# EAGLE design Pi3_motor_hat_rev1 (EAGLE 7.3.0)

## Sheet 1 of 2
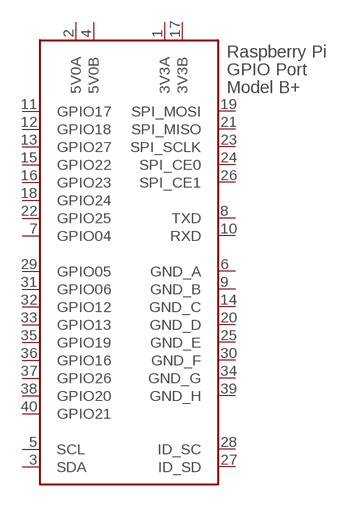
[diagram p0: schematic, sheet 1]

### Parts
X1  RASPI_BOARD_B+#_HDC  [RASPI_BOARD_B+HAT_DF_CF]
Unconnected: X1.3(SDA) X1.5(SCL) X1.7(GPIO04) X1.8(TXD) X1.10(RXD) X1.11(GPIO17) X1.12(GPIO18) X1.13(GPIO27) X1.15(GPIO22) X1.16(GPIO23) X1.18(GPIO24) X1.19(SPI_MOSI) X1.21(SPI_MISO) X1.22(GPIO25) X1.23(SPI_SCLK) X1.24(SPI_CE0) X1.26(SPI_CE1) X1.27(ID_SD) X1.28(ID_SC) X1.29(GPIO05) X1.31(GPIO06) X1.32(GPIO12) X1.33(GPIO13) X1.35(GPIO19) X1.36(GPIO16) X1.37(GPIO26) X1.38(GPIO20) X1.40(GPIO21)

## Sheet 2 of 2
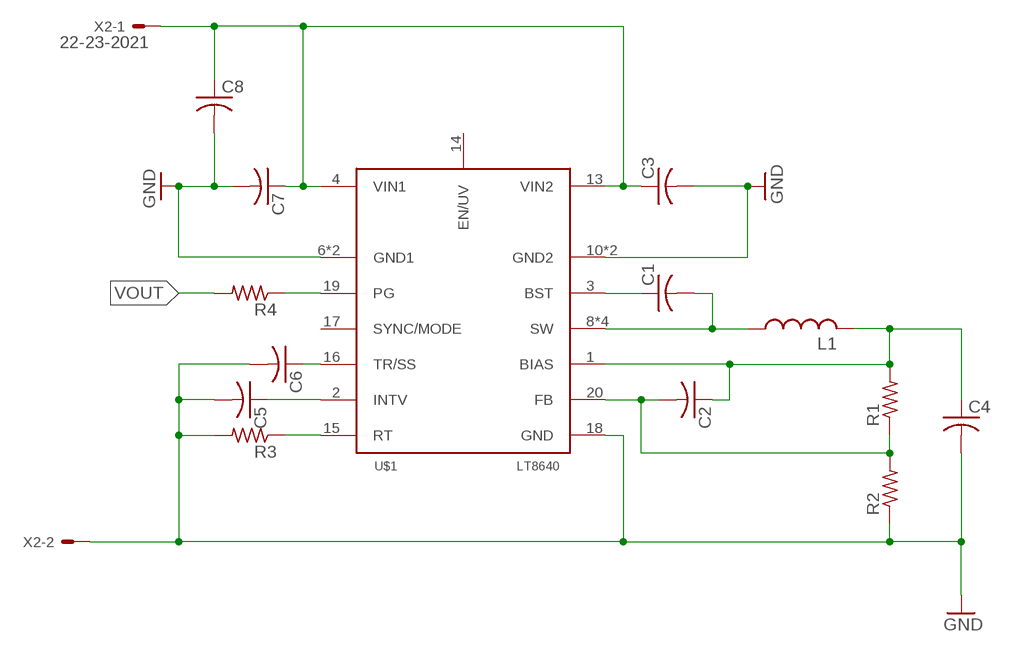
[diagram p1: schematic, sheet 2]

### Parts
C1  C-USC0402  [C0402]
C2  C-USC0402  [C0402]
C3  C-USC0402  [C0402]
C4  C-USC1210  [C1210]
C5  C-USC0402  [C0402]
C6  C-USC0402  [C0402]
C7  C-USC0402  [C0402]
C8  C-USC0603  [C0603]
L1  L-USIHLP2525EZER4R7M01  [IHLP2525EZER4R7M01-FOOT]
R1  R-US_R0402  [R0402]
R2  R-US_R0402  [R0402]
R3  R-US_R0402  [R0402]
R4  R-US_R0402  [R0402]
U$1  LT8640  [LT8640_FOOT]
X2  22-23-2021  [22-23-2021]

### Nets
GND: C3.2 C4.2 C5.2 C6.2 C7.2 C8.2 R2.1 R3.2 U$1.6(GND1) U$1.7(GND1) U$1.10(GND2) U$1.11(GND2) U$1.18(GND) X2.2
N$1: C1.1 U$1.3(BST)
N$2: C1.2 L1.1 U$1.8(SW) U$1.9(SW) U$1.21(SW) U$1.22(SW)
N$3: R4.1 U$1.19(PG)
N$5: C2.2 R1.1 R2.2 U$1.20(FB)
N$10: C6.1 U$1.16(TR/SS)
N$11: C5.1 U$1.2(INTV)
N$12: R3.1 U$1.15(RT)
VIN: C3.1 C7.1 C8.1 U$1.4(VIN1) U$1.13(VIN2) X2.1
VOUT: C2.1 C4.1 L1.2 R1.2 R4.2 U$1.1(BIAS)
Unconnected: U$1.14(EN/UV) U$1.17(SYNC/MODE)

## Power pins joined to a net without a drawn wire
3V3A: X1.1(3V3A)
3V3B: X1.17(3V3B)
5V0A: X1.2(5V0A)
5V0B: X1.4(5V0B)
GND_A: X1.6(GND_A)
GND_B: X1.9(GND_B)
GND_C: X1.14(GND_C)
GND_D: X1.20(GND_D)
GND_E: X1.25(GND_E)
GND_F: X1.30(GND_F)
GND_G: X1.34(GND_G)
GND_H: X1.39(GND_H)

## Library data of the parts
C1-C8 = rcl:C-US: CAPACITOR, American symbol
L1 = Pi3_motor_hat_rev1:L-US: INDUCTOR, American symbol
R1-R4 = rcl:R-US_: RESISTOR, American symbol
U$1 = Pi3_motor_hat_rev1:LT8640
X1 = raspberrypi_bastelstube_v13:RASPI_BOARD_B+#: Raspberry Pi GPIO connector with markings for the outer dimensions of the Raspberry Pi board model B+ with different sets of drill holes or mounting pads All pins connected
X2 = con-molex:22-23-2021: .100" (2.54mm) Center Header - 2 Pin; MF: MOLEX; MPN: 22-23-2021; OC_FARNELL: 1462926; OC_NEWARK: 25C3832

## Board
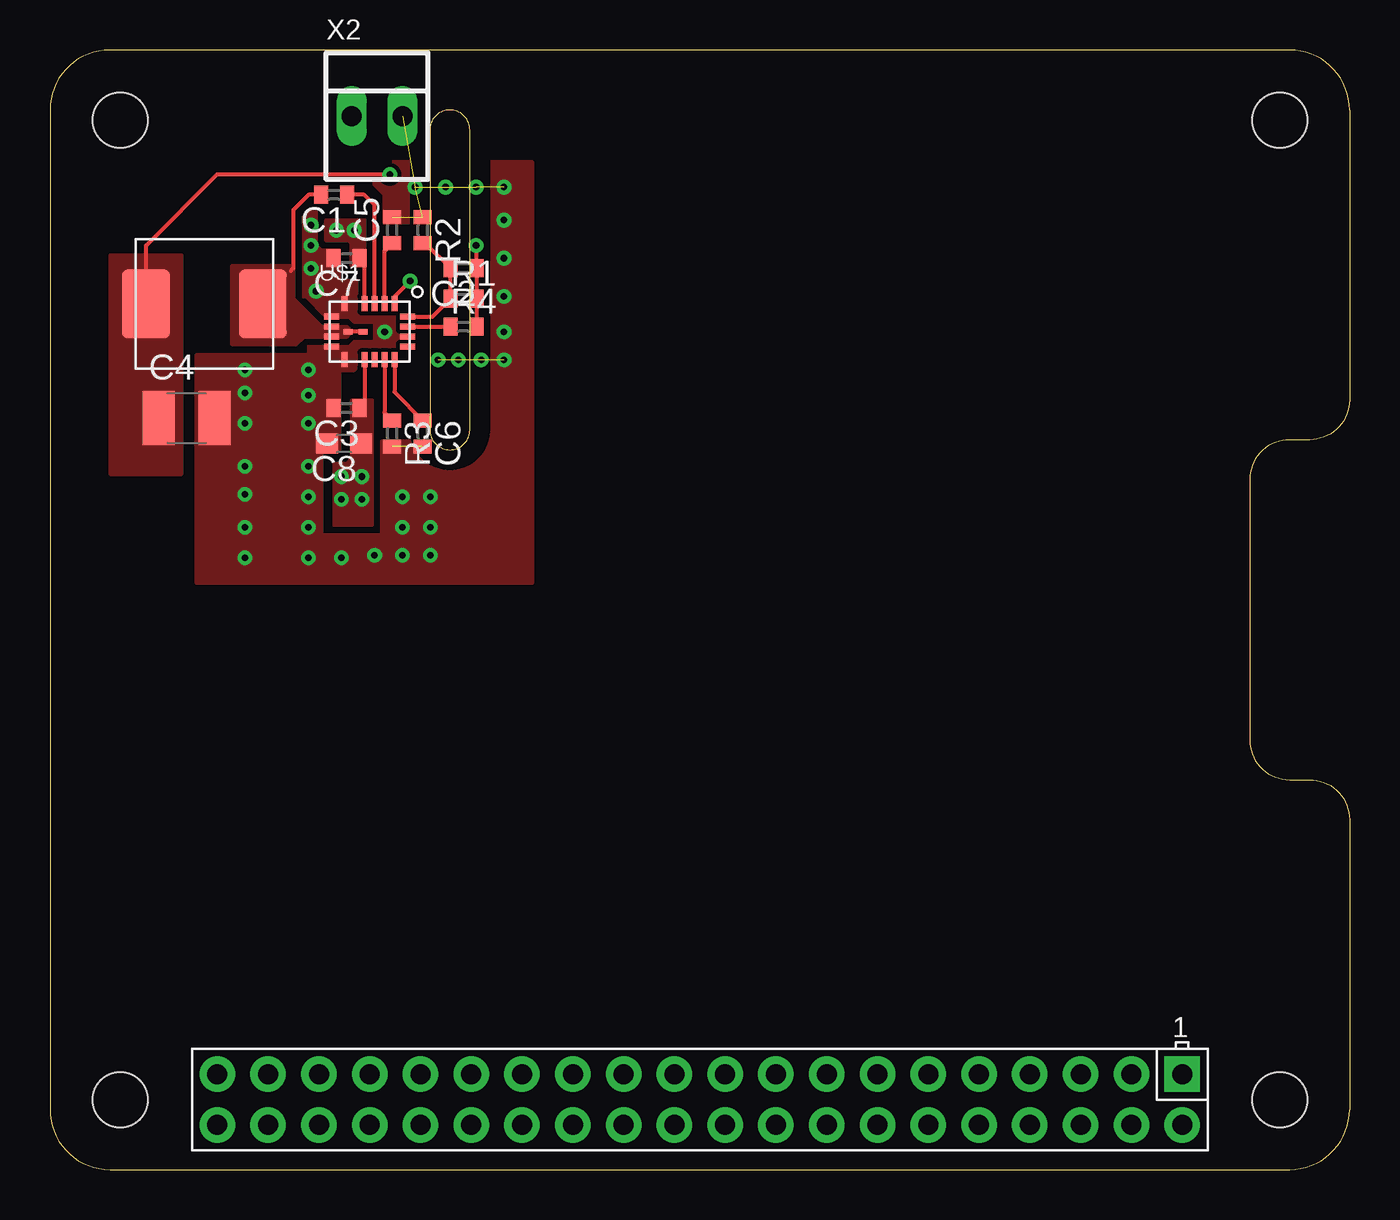
[diagram p2: board, top side]
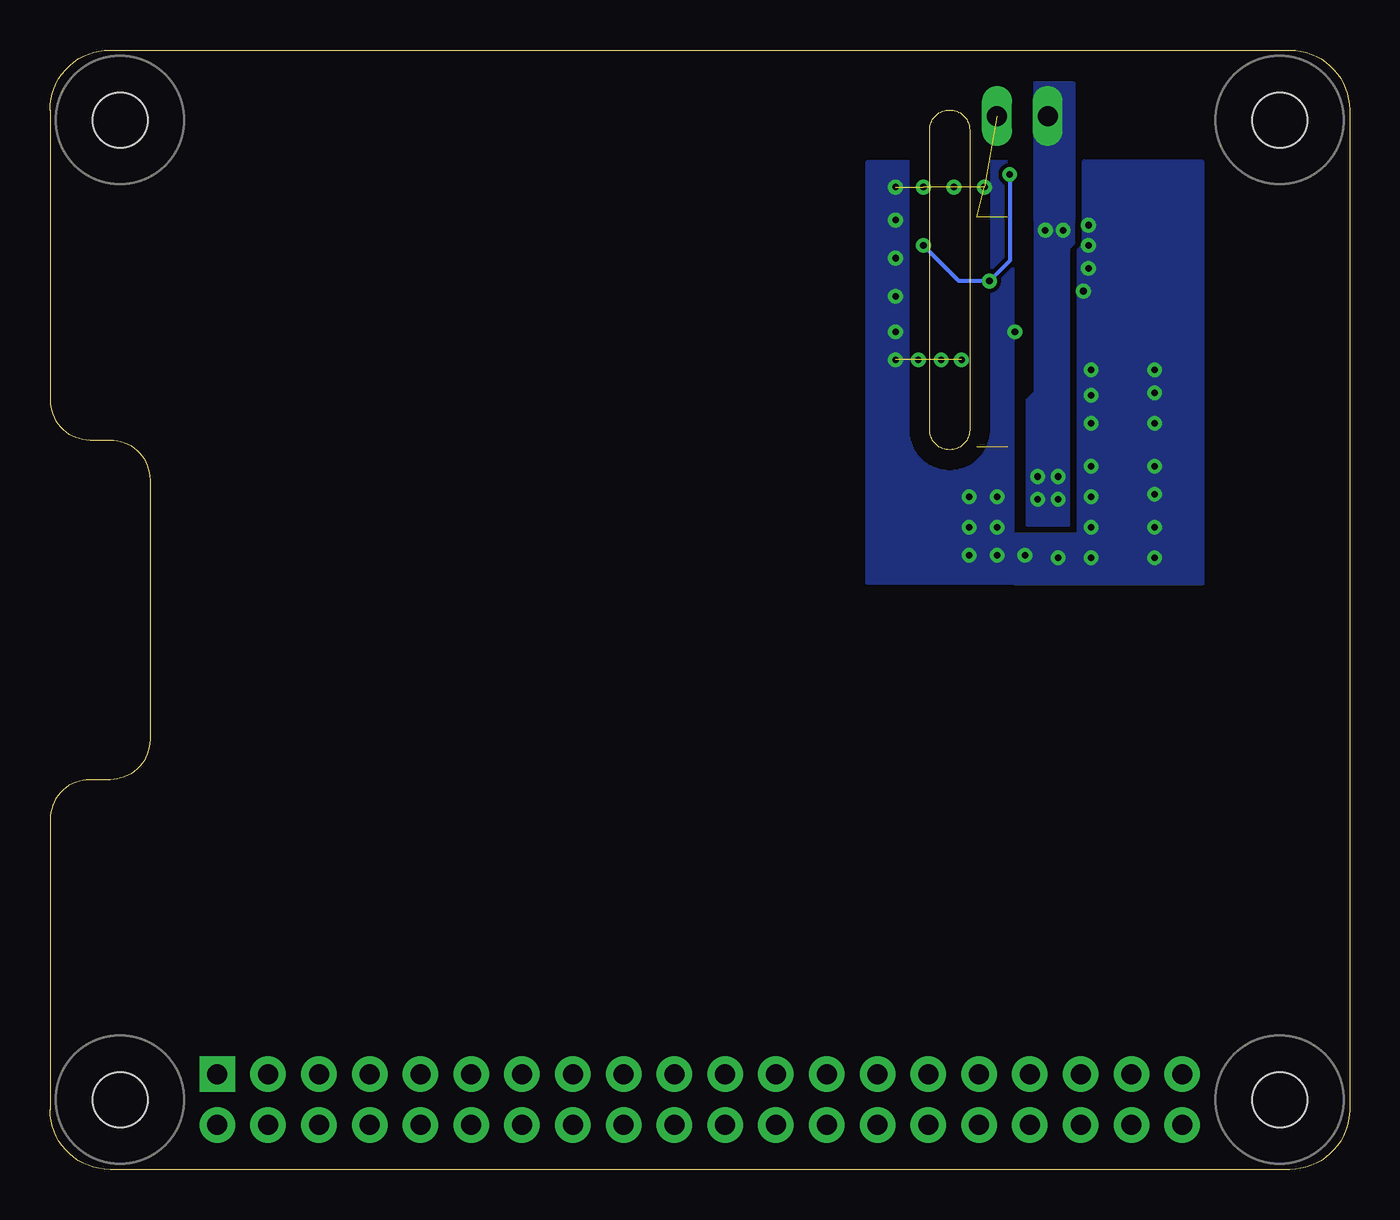
[diagram p3: board, bottom side, seen from below]

Size 65 x 56 mm. Coordinates in mm from the lower left corner, seen from the top.
Copper layers (1*16): Top 0.035mm / dielectric 1.5mm / Bottom 0.035mm
Design rules "default": minimum track width 10mil, minimum drill 24mil, track to track 8mil, track to pad 8mil, pad to pad 8mil, via to via 8mil, smd to smd 8mil, copper to edge 40mil, drill to drill 8mil, minimum pad ring 10mil, minimum via ring 8mil, stop-mask expansion 4mil, vias tented up to drill 0mil, thermal gap 10mil

### Footprints (pad centres in the part's own frame; a part is rotated, then mirrored left to right if it is on the bottom)
C0402 = smd 0.7 x 0.9: 1 -0.65,0; 2 0.65,0
C1210 = smd 1.6 x 2.7: 1 -1.4,0; 2 1.4,0
C0603 = smd 1.1 x 1: 1 -0.85,0; 2 0.85,0
IHLP2525EZER4R7M01-FOOT = smd 2.413 x 3.429: 1 -2.921,0; 2 2.921,0
R0402 = smd 0.7 x 0.9: 1 -0.65,0; 2 0.65,0
LT8640_FOOT = smd 0.3 x 0.75: 1 1.25,1.4; 2 0.75,1.4; 3 0.25,1.4; 4 -0.25,1.4; 6 -1.25,1.4; 11 -1.25,-1.4; 13 -0.25,-1.4; 14 0.25,-1.4; 15 0.75,-1.4; 16 1.25,-1.4 | smd 0.75 x 0.3: 7 -1.9,0.75; 8 -1.9,0.25; 9 -1.9,-0.25; 10 -1.9,-0.75; 17 1.9,-0.75; 18 1.9,-0.25; 19 1.9,0.25; 20 1.9,0.75 | smd 0.45 x 0.27: 21 -1.075,0; 22 -0.305,0
RASPI_BOARD_B+HAT_DF_CF = drill 1 pad 1.778 square: 1 8.37,51.23 | drill 1 pad 1.778: 2 8.37,53.77; 3 10.91,51.23; 4 10.91,53.77; 5 13.45,51.23; 6 13.45,53.77; 7 15.99,51.23; 8 15.99,53.77; 9 18.53,51.23; 10 18.53,53.77; 11 21.07,51.23; 12 21.07,53.77; 13 23.61,51.23; 14 23.61,53.77; 15 26.15,51.23; 16 26.15,53.77; 17 28.69,51.23; 18 28.69,53.77; 19 31.23,51.23; 20 31.23,53.77; 21 33.77,51.23; 22 33.77,53.77; 23 36.31,51.23; 24 36.31,53.77; 25 38.85,51.23; 26 38.85,53.77; 27 41.39,51.23; 28 41.39,53.77; 29 43.93,51.23; 30 43.93,53.77; 31 46.47,51.23; 32 46.47,53.77; 33 49.01,51.23; 34 49.01,53.77; 35 51.55,51.23; 36 51.55,53.77; 37 54.09,51.23; 38 54.09,53.77; 39 56.63,51.23; 40 56.63,53.77 | hole 2.75: 3.5,3.5; 3.5,52.5; 61.5,3.5; 61.5,52.5
22-23-2021 = drill 1 long: 1 -1.27,0; 2 1.27,0

### Placement (x,y rotation side)
C1  14.2,48.76 180 top
C2  20.68,45.08 180 top
C3  14.84,38.09 180 top
C4  6.83,37.59 0 top
C5  17.12,46.98 90 top
C6  18.65,36.82 270 top
C7  14.84,45.59 180 top
C8  14.71,36.31 180 top
L1  7.72,43.3 180 top
R1  20.68,43.55 0 top
R2  18.65,46.98 270 top
R3  17.12,36.82 270 top
R4  20.68,42.16 0 top
U$1  15.98,41.9 0 top
X1  65,56 180 top
X2  16.36,52.7 0 top

### Tracks (layer width: path | path; a pad name or v marks a point on that pad's centre or on a via)
GND  (via drill 0.33)  (10 unrouted)
  other vias: 13.06,47.24 13.06,46.22 13.06,45.08 13.31,43.93 16.74,41.9 12.93,40 12.93,38.73 12.93,37.33 12.93,35.17 12.93,33.65 12.93,32.12 12.93,30.6 14.58,30.6 16.23,30.73 17.63,30.73 17.63,32.12 17.63,33.65 19.03,33.65 19.03,32.12 19.03,30.73 18.26,49.14 19.79,49.14 21.31,49.14 22.71,49.14 22.71,47.49 22.71,45.59 22.71,43.68 22.71,41.9 22.71,40.51 21.57,40.51 20.42,40.51 19.41,40.51 9.76,40 9.76,38.85 9.76,37.33 9.76,35.17 9.76,33.77 9.76,32.12 9.76,30.6
  pour Top (no thermals): 13.82,42.66 14.96,42.66 15.22,42.41 16.23,42.41 16.23,41.39 15.22,41.39 14.96,41.14 12.93,41.14 12.93,40 15.22,40 15.34,40.12 15.34,40.63 17.76,40.63 17.76,43.3 15.6,43.3 15.6,44.44 12.8,44.44 12.8,43.68
  pour Top (no thermals): 7.34,33.77 7.34,40.76 14.45,40.76 14.45,35.93 13.57,35.93 13.57,33.77
  pour Top (no thermals): 17.63,41.27 24.11,41.27 24.11,29.33 7.34,29.33 7.34,33.77 13.57,33.77 13.57,31.74 16.61,31.74 16.61,36.44 19.53,36.44 19.53,38.47 17.76,40.25 17.76,41.14
  pour Top (no thermals): 14.45,44.44 14.45,45.97 13.57,45.97 13.31,46.22 13.31,47.87 12.93,47.87 12.68,47.62 12.68,43.68 13.69,43.68
  pour Top (no thermals): 16.74,47.36 16.74,48.76 16.23,49.27 16.23,50.41 24.11,50.41 24.11,41.27 22.07,41.27 22.07,46.86 21.57,47.36
  pour Bottom: 13.31,50.41 13.31,46.22 13.57,45.97 13.57,31.74 16.74,31.74 16.74,29.33 7.34,29.33 7.34,50.41
  pour Bottom: 16.87,50.41 16.87,31.74 16.74,31.74 16.74,29.33 24.11,29.33 24.11,50.41
  pour Top (no thermals): 18.01,41.78 19.03,41.78 19.28,41.52 19.28,41.01 18.77,41.01 18.77,41.27 18.52,41.52 18.01,41.52
N$1
  Top 0.203: U$1.3 16.23,48.26 15.72,48.76 C1.1
N$2
  Top 0.203: U$1.22 U$1.21 | C1.2 12.93,48.76 12.17,48 12.17,45.08 12.04,44.95
  pour Top (no thermals): 9.12,41.27 9.12,45.2 12.17,45.2 12.17,43.55 13.57,42.16 14.84,42.16 14.96,42.03 14.96,41.78 14.84,41.65 12.68,41.65 12.3,41.27
N$3
  Top 0.203: U$1.19 R4.1
N$5
  Top 0.203: U$1.20 19.13,42.65 R1.1 C2.2 18.77,46.33 R2.2
N$10
  Top 0.203: U$1.16 17.23,38.89 C6.1
N$11
  Top 0.203: U$1.2 16.73,45.94 C5.1
N$12
  Top 0.203: U$1.15 16.73,37.87 R3.1
VIN  (via drill 0.33)
  Top 0.203: U$1.4 15.73,45.22 C7.1 | U$1.13 15.73,38.34 C3.1
  other vias: 15.22,46.98 14.33,46.98 15.6,34.66 15.6,33.52 14.58,34.66 14.58,33.52
  pour Top (no thermals): 15.09,38.47 15.09,35.55 14.84,35.3 14.2,35.3 14.2,32.25 16.11,32.25 16.11,38.47
  pour Top (no thermals): 15.09,45.2 15.09,46.35 14.96,46.47 13.82,46.47 13.82,47.49 15.72,47.49 15.72,45.2
  pour Bottom: 14.07,32.25 14.07,46.09 13.82,46.35 13.82,47.49 15.72,47.49 15.72,38.85 16.11,38.47 16.11,32.25
  pour Bottom (no thermals): 15.72,47.49 15.72,54.35 13.82,54.35 13.82,47.49
VOUT  (via drill 0.33)
  Top 0.203: U$1.1 17.23,43.66 v18.01,44.44 | v21.31,46.22 21.31,45.09 C2.1 R1.2 R4.2 | L1.2 4.8,46.22 8.36,49.78 v16.99,49.78
  Bottom 0.203: v21.31,46.22 19.53,44.44 v18.01,44.44 16.99,45.46 v16.99,49.78
  pour Top (no thermals): 6.58,34.79 6.58,45.71 3.02,45.71 3.02,34.79